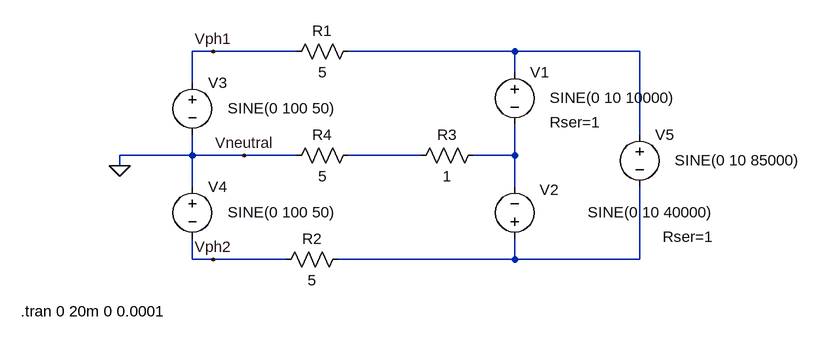
[diagram p0: schematic Draft1.asc]
Draft1.asc, the LTspice schematic file:
Version 4
SHEET 1 880 680
WIRE -176 0 -208 0
WIRE -48 0 -176 0
WIRE 288 0 32 0
WIRE 480 0 288 0
WIRE 288 32 288 0
WIRE -208 48 -208 0
WIRE 480 128 480 0
WIRE -208 160 -208 128
WIRE -208 160 -320 160
WIRE -128 160 -208 160
WIRE -48 160 -128 160
WIRE 144 160 32 160
WIRE 288 160 288 112
WIRE 288 160 224 160
WIRE -320 176 -320 160
WIRE -208 208 -208 160
WIRE 288 208 288 160
WIRE -208 320 -208 288
WIRE -176 320 -208 320
WIRE -64 320 -176 320
WIRE 288 320 288 288
WIRE 288 320 16 320
WIRE 480 320 480 208
WIRE 480 320 288 320
FLAG -320 176 0
FLAG -176 0 Vph1
FLAG -176 320 Vph2
FLAG -128 160 Vneutral
SYMBOL voltage 288 16 R0
WINDOW 3 54 55 Left 2
WINDOW 123 0 0 Left 2
WINDOW 39 54 93 Left 2
SYMATTR Value SINE(0 10 10000)
SYMATTR SpiceLine Rser=1
SYMATTR InstName V1
SYMBOL voltage 288 304 R180
WINDOW 0 -68 91 Left 2
WINDOW 3 -306 57 Left 2
WINDOW 123 0 0 Left 2
WINDOW 39 -306 19 Left 2
SYMATTR InstName V2
SYMATTR Value SINE(0 10 40000)
SYMATTR SpiceLine Rser=1
SYMBOL voltage -208 32 R0
WINDOW 3 54 55 Left 2
WINDOW 123 0 0 Left 2
WINDOW 39 54 93 Left 2
SYMATTR Value SINE(0 100 50)
SYMATTR InstName V3
SYMBOL voltage -208 192 R0
WINDOW 3 54 55 Left 2
WINDOW 123 0 0 Left 2
WINDOW 39 54 93 Left 2
SYMATTR Value SINE(0 100 50)
SYMATTR InstName V4
SYMBOL res 48 -16 R90
WINDOW 0 0 56 VBottom 2
WINDOW 3 32 56 VTop 2
SYMATTR InstName R1
SYMATTR Value 5
SYMBOL res 32 304 R90
WINDOW 0 0 56 VBottom 2
WINDOW 3 32 56 VTop 2
SYMATTR InstName R2
SYMATTR Value 5
SYMBOL voltage 480 112 R0
WINDOW 3 54 55 Left 2
WINDOW 123 0 0 Left 2
WINDOW 39 0 0 Left 2
SYMATTR Value SINE(0 10 85000)
SYMATTR InstName V5
SYMBOL res 128 176 R270
WINDOW 0 32 56 VTop 2
WINDOW 3 0 56 VBottom 2
SYMATTR InstName R3
SYMATTR Value 1
SYMBOL res 48 144 R90
WINDOW 0 0 56 VBottom 2
WINDOW 3 32 56 VTop 2
SYMATTR InstName R4
SYMATTR Value 5
TEXT -472 400 Left 2 !.tran 0 20m 0 0.0001

The netlist it stands for:
* Draft1.asc
V1 N001 N003 SINE(0 10 10000) Rser=1
V2 N004 N003 SINE(0 10 40000) Rser=1
V3 Vph1 0 SINE(0 100 50)
V4 0 Vph2 SINE(0 100 50)
R1 N001 Vph1 5
R2 N004 Vph2 5
V5 N001 N004 SINE(0 10 85000)
R3 N002 N003 1
R4 N002 0 5
.tran 0 20m 0 0.0001
.backanno
.end

* Results of the author's LTspice run, read from the files saved beside the schematic
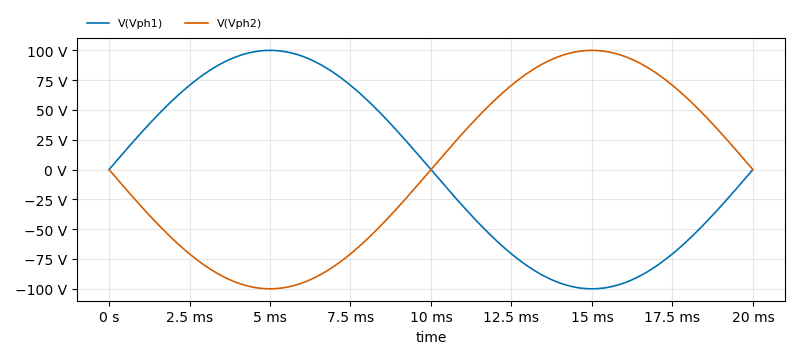
[diagram p1: Transient Analysis of Draft1.asc, plotted from the saved traces]
* Transient Analysis, 1 run:
*   V(Vph1): min -100 V, max 100 V, average 0 V, rms 70.71 V, last 0 V
*   V(Vph2): min -100 V, max 100 V, average 0 V, rms 70.71 V, last 0 V